# EAGLE schematic PCB-111000_V2 (EAGLE 9.6.2)
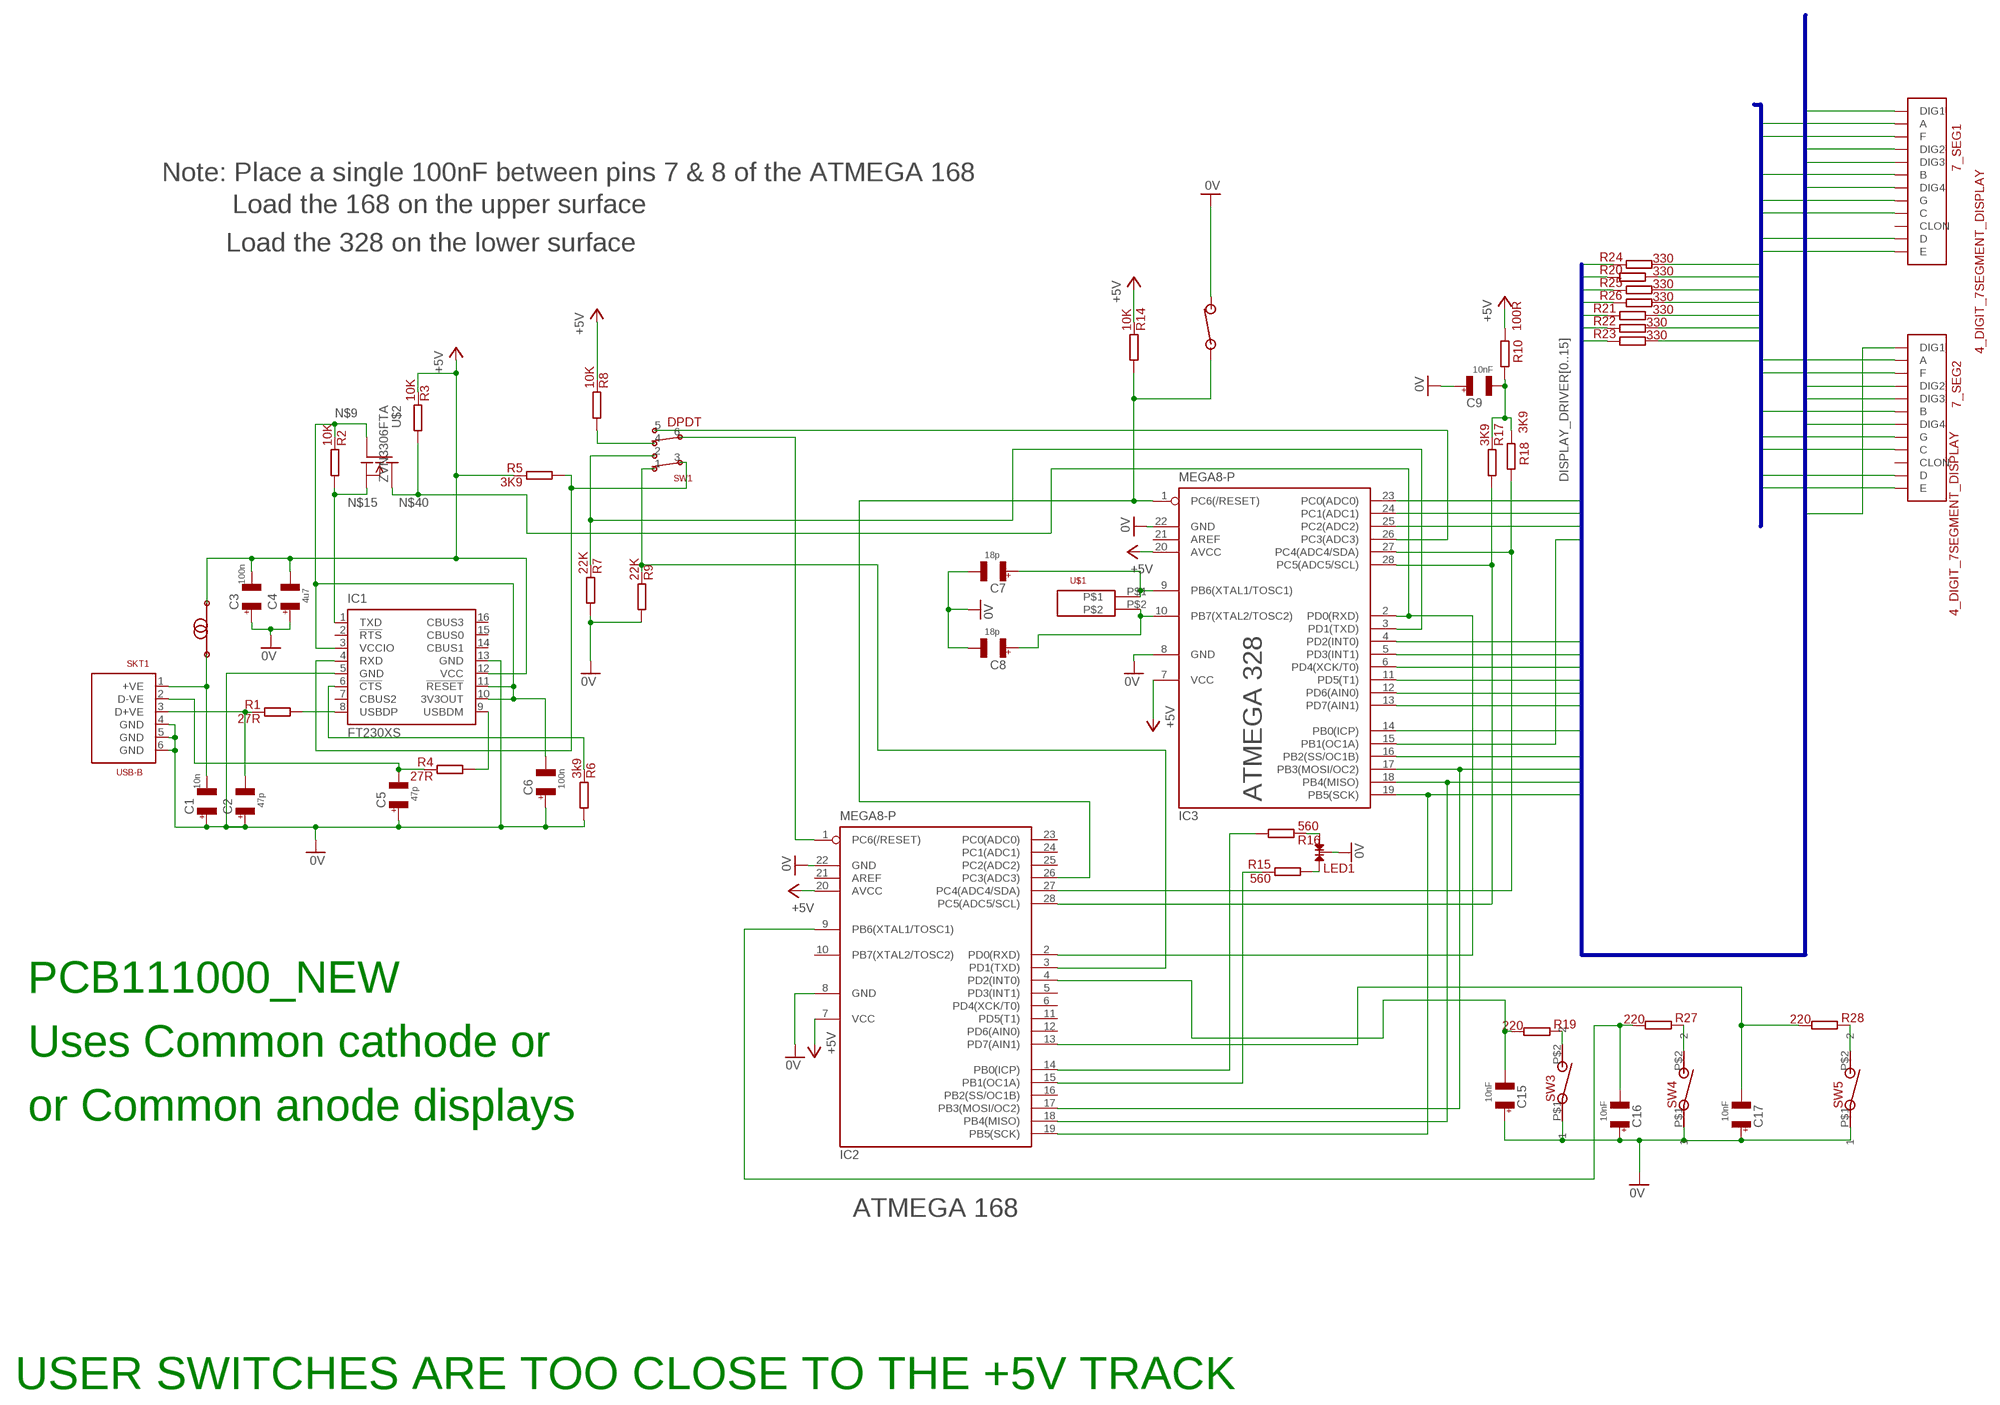
[diagram p0: schematic, sheet 1]

## Parts
7_SEG1  4_DIGIT_7SEGMENT_DISPLAY  [4_DIGIT_7SEGMENT_DISPLAY]
7_SEG2  4_DIGIT_7SEGMENT_DISPLAY  [4_DIGIT_7SEGMENT_DISPLAY]
C1  10n  1206C  [1206]
C2  47p  1206C  [1206]
C3  100n  1206C  [1206]
C4  4u7  1206C  [1206]
C5  47p  1206C  [1206]
C6  100n  1206C  [1206]
C7  18p  0805C  [0805]
C8  18p  0805C  [0805]
C9  10nF  1206C  [1206]
C15  10nF  1206C  [1206]
C16  10nF  1206C  [1206]
C17  10nF  1206C  [1206]
IC1  FT230XS  [SSOP16]
IC2  MEGA8-P  [DIL28-3]
IC3  MEGA8-P  [DIL28-3]
L1  CHOKE  [1206]
LED1  LED  [CA_DUAL_LED]
R1  27R  1206R  [1206]
R2  10K  1206R  [1206]
R3  10K  1206R  [1206]
R4  27R  1206R  [1206]
R5  3K9  1206R  [1206]
R6  3k9  1206R  [1206]
R7  22K  1206R  [1206]
R8  10K  1206R  [1206]
R9  22K  1206R  [1206]
R10  100R  1206R  [1206]
R14  10K  1206R  [1206]
R15  560  1206R  [1206]
R16  560  1206R  [1206]
R17  3K9  1206R  [1206]
R18  3K9  1206R  [1206]
R19  220  1206R  [1206]
R20  330  1206R  [1206]
R21  330  1206R  [1206]
R22  330  1206R  [1206]
R23  330  1206R  [1206]
R24  330  1206R  [1206]
R25  330  1206R  [1206]
R26  330  1206R  [1206]
R27  220  1206R  [1206]
R28  220  1206R  [1206]
SKT1  USB-B  [USB-B]
SW1  DPDT  [DPDT_SWITCH]
SW2  NO_SW  [SM_NO_PUSH_BUTTON]
SW3  NO_PB_1  [RE51-0711]
SW4  NO_PB_1  [RE51-0711]
SW5  NO_PB_1  [RE51-0711]
U$1  XTAL  [XTAL_VIAS]
U$2  ZVN3306FTA  [SOT-23]

## Nets
0V: C1.P$1 C2.P$1 C3.P$1 C4.P$1 C5.P$1 C6.P$1 C7.2 C8.2 C9.P$1 C15.P$1 C16.P$1 C17.P$1 IC1.5(GND) IC1.13(GND) IC2.8(GND) IC2.22(GND) IC3.8(GND) IC3.22(GND) LED1.2 R6.P$1 R7.P$1 R9.P$1 SKT1.4(GND) SKT1.5(GND) SKT1.6(GND) SW2.P$2 SW3.P$1 SW4.P$1 SW5.P$1
+5V: C3.P$2 C4.P$2 IC1.12(VCC) IC2.7(VCC) IC2.20(AVCC) IC3.7(VCC) IC3.20(AVCC) L1.P$2 R3.P$2 R5.P$2 R8.P$2 R10.P$2 R14.P$2
DISPLAY_DRIVER0: IC3.15(PB1(OC1A)) R24.P$2
DISPLAY_DRIVER1: IC3.4(PD2(INT0)) R20.P$2
DISPLAY_DRIVER2: IC3.5(PD3(INT1)) R25.P$2
DISPLAY_DRIVER3: IC3.6(PD4(XCK/T0)) R26.P$2
DISPLAY_DRIVER4: IC3.11(PD5(T1)) R21.P$2
DISPLAY_DRIVER5: IC3.12(PD6(AIN0)) R22.P$2
DISPLAY_DRIVER6: IC3.13(PD7(AIN1)) R23.P$2
DISPLAY_DRIVER8: 7_SEG2.P$12(DIG1) IC3.14(PB0(ICP))
DISPLAY_DRIVER9: 7_SEG2.P$9(DIG2) IC3.16(PB2(SS/OC1B))
DISPLAY_DRIVER10: 7_SEG2.P$8(DIG3) IC2.17(PB3(MOSI/OC2)) IC3.17(PB3(MOSI/OC2))
DISPLAY_DRIVER11: 7_SEG2.P$6(DIG4) IC2.18(PB4(MISO)) IC3.18(PB4(MISO))
DISPLAY_DRIVER12: 7_SEG1.P$12(DIG1) IC2.19(PB5(SCK)) IC3.19(PB5(SCK))
DISPLAY_DRIVER13: 7_SEG1.P$9(DIG2) IC3.23(PC0(ADC0))
DISPLAY_DRIVER14: 7_SEG1.P$8(DIG3) IC3.24(PC1(ADC1))
DISPLAY_DRIVER15: 7_SEG1.P$6(DIG4) IC3.25(PC2(ADC2))
N$1: IC2.14(PB0(ICP)) R16.P$1
N$2: IC2.15(PB1(OC1A)) R15.P$2
N$3: LED1.1 R15.P$1
N$4: LED1.3 R16.P$2
N$5: IC3.26(PC3(ADC3)) SW1.5
N$6: IC3.3(PD1(TXD)) R7.P$2 SW1.2
N$7: R27.P$2 SW4.P$2
N$8: R19.P$2 SW3.P$2
N$9: C6.P$2 IC1.3(VCCIO) IC1.10(3V3OUT) IC1.11(!RESET) R2.P$2 U$2.3(G)
N$10: C7.1 IC3.9(PB6(XTAL1/TOSC1)) U$1.P$1
N$11: C17.P$2 IC2.13(PD7(AIN1)) R28.P$1
N$12: C8.1 IC3.10(PB7(XTAL2/TOSC2)) U$1.P$2
N$13: R8.P$1 SW1.4
N$14: IC2.3(PD1(TXD)) R9.P$2 SW1.1
N$15: IC1.1(TXD) R2.P$1 U$2.2(S)
N$16: R28.P$2 SW5.P$2
N$17: C15.P$2 IC2.4(PD2(INT0)) R19.P$1
N$18: IC1.9(USBDM) R4.P$1
N$19: C16.P$2 IC2.9(PB6(XTAL1/TOSC1)) R27.P$1
N$20: C9.P$2 R10.P$1 R17.P$2 R18.P$2
N$25: IC1.8(USBDP) R1.P$1
N$26: IC2.1(PC6(/RESET)) SW1.6
N$27: C5.P$2 R4.P$2 SKT1.2(D-VE)
N$29: C2.P$2 R1.P$2 SKT1.3(D+VE)
N$30: C1.P$2 L1.P$1 SKT1.1(+VE)
N$31: IC2.26(PC3(ADC3)) IC3.1(PC6(/RESET)) R14.P$1 SW2.P$1
N$34: IC1.6(!CTS) R6.P$2
N$35: IC1.4(RXD) R5.P$1 SW1.3
N$38: IC2.28(PC5(ADC5/SCL)) IC3.28(PC5(ADC5/SCL)) R17.P$1
N$39: IC2.27(PC4(ADC4/SDA)) IC3.27(PC4(ADC4/SDA)) R18.P$1
N$40: IC2.2(PD0(RXD)) IC3.2(PD0(RXD)) R3.P$1 U$2.1(D)
SEVEN_SEG0: 7_SEG1.P$11(A) 7_SEG2.P$11(A) R24.P$1
SEVEN_SEG1: 7_SEG1.P$7(B) 7_SEG2.P$7(B) R20.P$1
SEVEN_SEG2: 7_SEG1.P$4(C) 7_SEG2.P$4(C) R25.P$1
SEVEN_SEG3: 7_SEG1.P$2(D) 7_SEG2.P$2(D) R26.P$1
SEVEN_SEG4: 7_SEG1.P$1(E) 7_SEG2.P$1(E) R21.P$1
SEVEN_SEG5: 7_SEG1.P$10(F) 7_SEG2.P$10(F) R22.P$1
SEVEN_SEG6: 7_SEG1.P$5(G) 7_SEG2.P$5(G) R23.P$1
Unconnected: 7_SEG1.P$3(CLON) 7_SEG2.P$3(CLON) IC1.2(!RTS) IC1.7(CBUS2) IC1.14(CBUS1) IC1.15(CBUS0) IC1.16(CBUS3) IC2.5(PD3(INT1)) IC2.6(PD4(XCK/T0)) IC2.10(PB7(XTAL2/TOSC2)) IC2.11(PD5(T1)) IC2.12(PD6(AIN0)) IC2.16(PB2(SS/OC1B)) IC2.21(AREF) IC2.23(PC0(ADC0)) IC2.24(PC1(ADC1)) IC2.25(PC2(ADC2)) IC3.21(AREF)

## Buses
SEVEN_SEG[0..7]
DISPLAY_DRIVER[0..15]

## Notes on the sheet
- Note: Place a single 100nF between pins 7 & 8 of the ATMEGA 168
- Load the 168 on the upper surface
- Load the 328 on the lower surface
- ATMEGA 328
- PCB111000_NEW
- Uses Common cathode or
- or Common anode displays
- ATMEGA 168
- USER SWITCHES ARE TOO CLOSE TO THE +5V TRACK

## Library data of the parts
7_SEG1 7_SEG2 = 1_marko:4_DIGIT_7SEGMENT_DISPLAY: Common Anode RE 55-1674
C1-C6 C9 C15-C17 = 1_Home_library:1206C: 4.7uF RS 538-2335 100nF RS 264-4179
C7 C8 = 1_3V3_Bootloader:0805C: 1uF RS 451-5770 10nF 264-4371 100nF 264-4416
IC1 = 1_3V3_Bootloader:FT230X: USB to BASIC UART IC RS 757-0010
IC2 IC3 = 1_Home_library:MEGA8-P: MICROCONTROLLER 8 Kbytes FLASH, 1 kbytes SRAM, 512 bytes EEPROM, USART, 4-channel 10 bit ADC, 2-channel 8 bit ADC Pin compatible with Atmega48, ATMega88, ATMega168 Source: avr.lbr; OC_FARNELL: unknown; OC_NEWARK: unknown
L1 = 1_Home_library:CHOKE: RS 724-1582 1206 inductor
LED1 = 3_My_prog:LED: RS228-5770
R1-R10 R14-R28 = 1_Home_library:1206R
SKT1 = 3_My_prog:USB-B: RS 515-1967
SW1 = 1_Home_library:DPDT: DPST switch RE 76-0100
SW2 = 1_Home_library:NO_SW: SM NO push button RE 51-0709
SW3-SW5 = 1_3V3_Bootloader:NO_PB_1: RE 51-0711
U$1 = 1_3V3_Bootloader:XTAL: Watch Crystal RS 478-9268
U$2 = mo:ZVN3306FTA